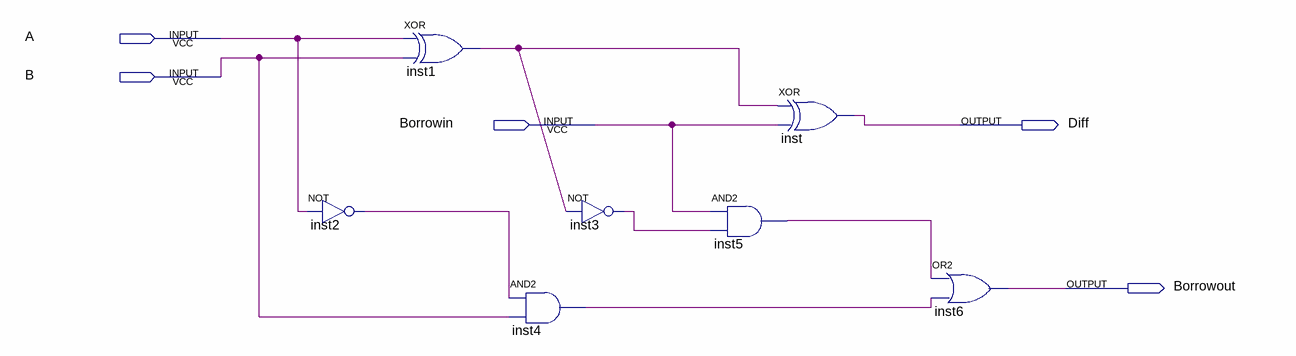
[diagram p0: schematic sheet]
// Quartus schematic Aula7.bdf as structural Verilog: 7 symbols, 5 pins
module Aula7 (
  input  A,
  input  B,
  input  Borrowin,
  output Diff,
  output Borrowout
);

  wire inst1_out, inst2_out, inst3_out, inst4_out, inst5_out;

  not inst2 (inst2_out, A);
  xor inst1 (inst1_out, A, B);
  not inst3 (inst3_out, inst1_out);
  and inst4 (inst4_out, inst2_out, B);
  and inst5 (inst5_out, Borrowin, inst3_out);
  xor inst (Diff, inst1_out, Borrowin);
  or inst6 (Borrowout, inst5_out, inst4_out);
endmodule
